# EAGLE board 14320^4 (EAGLE 7.6.0), part 1 of 2
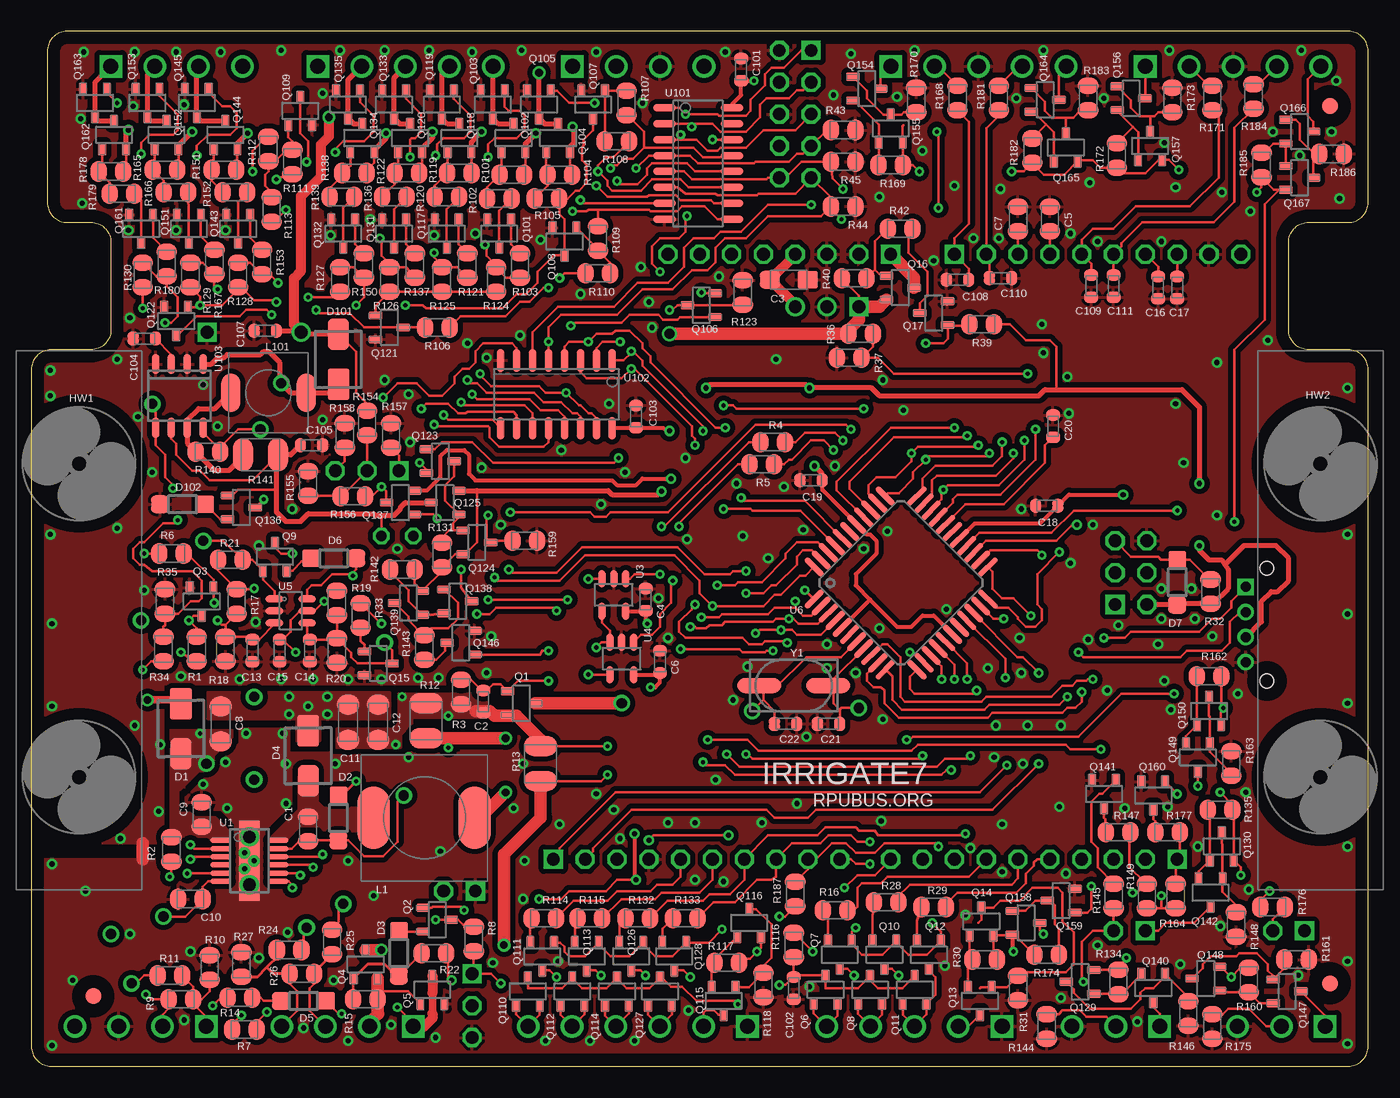
[diagram p2: board, top side]
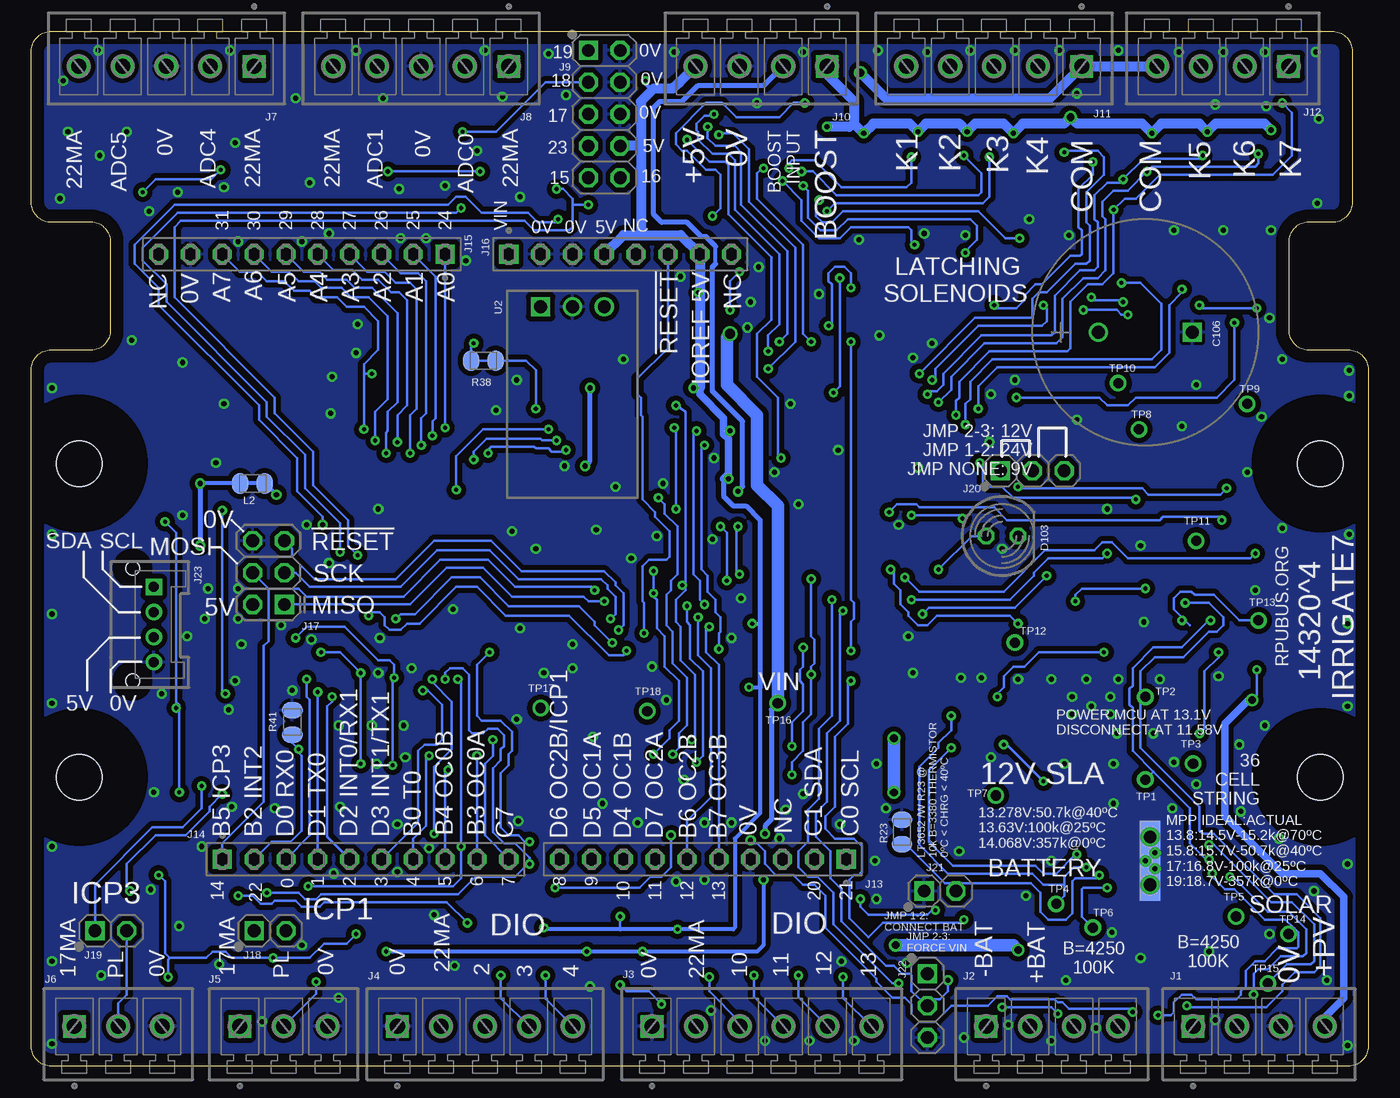
[diagram p3: board, bottom side, seen from below]

Size 106.68 x 82.55 mm. Coordinates in mm from the lower left corner, seen from the top.
Outline: 0,55.56 0,1.59 arc90 1.59,0 105.09,0 arc90 106.68,1.59 106.68,55.56 arc90 105.09,57.15 101.92,57.15 arc-90 100.33,58.74 100.33,65.72 arc-90 101.92,67.31 105.09,67.31 arc90 106.68,68.9 106.68,80.96 arc90 105.09,82.55 2.86,82.55 arc90 1.27,80.96 1.27,68.9 arc90 2.86,67.31 4.76,67.31 arc-90 6.35,65.72 6.35,58.74 arc-90 4.76,57.15 1.59,57.15 arc90 0,55.56
Copper layers (1*16): Top 0.035mm / dielectric 1.5mm / Bottom 0.035mm
Design rules "default *": minimum track width 10mil, minimum drill 16mil, track to track 8mil, track to pad 8mil, pad to pad 8mil, via to via 8mil, smd to smd 8mil, copper to edge 40mil, drill to drill 8mil, minimum pad ring 10mil, minimum via ring 8mil, stop-mask expansion 4mil, vias tented up to drill 17mil, thermal gap 10mil
Net classes: 0 default: width 0.254 mm, drill 0.33 mm

## Footprints (pad centres in the part's own frame; a part is rotated, then mirrored left to right if it is on the bottom)
C0805(2012) = smd 1.321 x 1.651: 1 -0.977,0; 2 0.977,0
C0603(1608) = smd 0.898 x 1.1: 1 -0.889,0; 2 0.889,0
3216 = smd 1.6 x 1.4: + -1.5,0; - 1.5,0
C1206(3216) = smd 1.6 x 1.8: 1 -1.4,0; 2 1.4,0
E7,5-18 = drill 1.016: + -3.75,0 | drill 1.016 square: - 3.75,0
SMA = smd 2.5 x 1.7: A 2,0; K -2,0
SOD123 = smd 1.4 x 1.4: A 1.8,0; C -1.8,0
LED5MM = drill 0.813 octagon: A -1.27,0; K 1.27,0
USA10 = hole 3.658: -12.5,0; 12.5,0
MCV4 = drill 1.2 square: 1 0,0 | drill 1.2: 2 3.5,0; 3 7,0; 4 10.5,0
MCV6 = drill 1.2 square: 1 0,0 | drill 1.2: 2 3.5,0; 3 7,0; 4 10.5,0; 5 14,0; 6 17.5,0
MCV5 = drill 1.2 square: 1 0,0 | drill 1.2: 2 3.5,0; 3 7,0; 4 10.5,0; 5 14,0
MCV3 = drill 1.2 square: 1 0,0 | drill 1.2: 2 3.5,0; 3 7,0
2X5 = drill 1.016 square: 1 0,0 | drill 1.016 octagon: 2 0,2.54; 3 2.54,0; 4 2.54,2.54; 5 5.08,0; 6 5.08,2.54; 7 7.62,0; 8 7.62,2.54; 9 10.16,0; 10 10.16,2.54
F1X10 = drill 1.016 square: 1 0,0 | drill 1.016 octagon: 2 2.54,0; 3 5.08,0; 4 7.62,0; 5 10.16,0; 6 12.7,0; 7 15.24,0; 8 17.78,0; 9 20.32,0; 10 22.86,0
F1X8 = drill 1.016 square: 1 0,0 | drill 1.016 octagon: 2 2.54,0; 3 5.08,0; 4 7.62,0; 5 10.16,0; 6 12.7,0; 7 15.24,0; 8 17.78,0
ISP = drill 1.016 square: 1 0,0 | drill 1.016 octagon: 2 0,2.54; 3 2.54,0; 4 2.54,2.54; 5 5.08,0; 6 5.08,2.54
1X2 = drill 1.016 square: 1 0,0 | drill 1.016 octagon: 2 2.54,0
1X3 = drill 1.016 square: 1 0,0 | drill 1.016 octagon: 2 2.54,0; 3 5.08,0
B04B = drill 0.8 square: 1 0,0 | drill 0.8: 2 2,0; 3 4,0; 4 6,0 | hole 1.1: 7.5,-1.7; -1.5,-1.7
L3939 = smd 2.6 x 5: 1 4.05,0; 2 -4.01,0
L2626 = smd 1.524 x 3.048: 1 3.01,0; 2 -3.01,0
SOT23 = smd 0.65 x 1.06: 1(G) -0.95,-1.1; 2(S) 0.95,-1.1; 3(D) 0,1.1
SOT23' = smd 0.65 x 1.06: B -0.95,-1.1; C 0,1.1; E 0.95,-1.1
C1210(3225) = smd 1.6 x 2.7: 1 -1.4,0; 2 1.4,0
P1-08 = drill 0.813: TP 0,0
12MSOP-EDP-HAND = smd 0.42 x 1.6: 1 -1.625,-2.3; 2 -0.975,-2.3; 3 -0.325,-2.3; 4 0.325,-2.3; 5 0.975,-2.3; 6 1.625,-2.3; 7 1.625,2.3; 8 0.975,2.3; 9 0.325,2.3; 10 -0.325,2.3; 11 -0.975,2.3; 12 -1.625,2.3 | smd 6.35 x 1.651: SNK0 0,0 | smd 6.35 x 1.651 bottom: SNK1 0,0 | drill 1.016: SNK3 -1.905,0; SNK5 1.905,0 | drill 0.406: SNK4 0,0.381; SNK6 -0.635,-0.381; SNK7 0.635,-0.381
OKI-78SR-H = drill 1.016 square: 1 0,0 | drill 1.016: 2 -2.54,0; 3 -5.08,0
SOT23-5 = smd 0.55 x 1.4: 1 -0.95,-1.3; 2 0,-1.3; 3 0.95,-1.3; 4 0.95,1.3; 5 -0.95,1.3
SOT23-6 = smd 0.55 x 1.4: 1 -0.95,-1.3; 2 0,-1.3; 3 0.95,-1.3; 4 0.95,1.3; 5 0,1.3; 6 -0.95,1.3
TQFP44 = smd 2 x 0.45: 1 -5.8,4; 2 -5.8,3.2; 3 -5.8,2.4; 4 -5.8,1.6; 5 -5.8,0.8; 6 -5.8,0; 7 -5.8,-0.8; 8 -5.8,-1.6; 9 -5.8,-2.4; 10 -5.8,-3.2; 11 -5.8,-4; 23 5.8,-4; 24 5.8,-3.2; 25 5.8,-2.4; 26 5.8,-1.6; 27 5.8,-0.8; 28 5.8,0; 29 5.8,0.8; 30 5.8,1.6; 31 5.8,2.4; 32 5.8,3.2; 33 5.8,4 | smd 0.45 x 2: 12 -4,-5.8; 13 -3.2,-5.8; 14 -2.4,-5.8; 15 -1.6,-5.8; 16 -0.8,-5.8; 17 0,-5.8; 18 0.8,-5.8; 19 1.6,-5.8; 20 2.4,-5.8; 21 3.2,-5.8; 22 4,-5.8; 34 4,5.8; 35 3.2,5.8; 36 2.4,5.8; 37 1.6,5.8; 38 0.8,5.8; 39 0,5.8; 40 -0.8,5.8; 41 -1.6,5.8; 42 -2.4,5.8; 43 -3.2,5.8; 44 -4,5.8
16SOIC = smd 0.6 x 1.8: 1 -4.445,-2.7; 2 -3.175,-2.7; 3 -1.905,-2.7; 4 -0.635,-2.7; 5 0.635,-2.7; 6 1.905,-2.7; 7 3.175,-2.7; 8 4.445,-2.7; 9 4.445,2.7; 10 3.175,2.7; 11 1.905,2.7; 12 0.635,2.7; 13 -0.635,2.7; 14 -1.905,2.7; 15 -3.175,2.7; 16 -4.445,2.7
SOIC8 = smd 0.6 x 1.6: 1 -1.905,-2.54; 2 -0.635,-2.54; 3 0.635,-2.54; 4 1.905,-2.54; 5 1.905,2.54; 6 0.635,2.54; 7 -0.635,2.54; 8 -1.905,2.54
FIDUCIAL-1.27 = smd 1.27 x 1.27: 1 0,0
CSM-3X = smd 3.5 x 1.2: 1 -2.75,0; 2 2.75,0

## Placement (x,y rotation side)
C1  1uF  [C0805(2012)]  22.1,18.92 90 top
C2  10nF  [C0603(1608)]  36.07,29.08 90 top
C3  106A  [3216]  60.45,62.74 0 top
C4  .1uF  [C0603(1608)]  49.02,37.21 90 top
C5  1uF  [C0805(2012)]  81.28,67.56 90 top
C6  .1uF  [C0603(1608)]  50.16,32.26 90 top
C7  1uF  [C0805(2012)]  78.74,67.56 90 top
C8  10uF  [C1206(3216)]  15.11,27.3 90 top
C9  .1uF  [C0805(2012)]  13.59,20.07 90 top
C10  1uF  [C0805(2012)]  12.7,13.34 180 top
C11  10uF  [C1206(3216)]  25.27,27.43 90 top
C12  10uF  [C1206(3216)]  27.69,27.43 90 top
C13  .1uF  [C0603(1608)]  17.65,33.15 270 top
C14  .1uF  [C0603(1608)]  22.23,33.15 270 top
C15  .1uF  [C0603(1608)]  19.81,33.15 270 top
C16  .01uF  [C0603(1608)]  89.92,62.1 270 top
C17  .01uF  [C0603(1608)]  91.44,62.1 270 top
C18  .1uF  [C0603(1608)]  81.03,44.7 180 top
C19  .1uF  [C0603(1608)]  62.23,46.74 180 top
C20  .1uF  [C0603(1608)]  81.53,51.05 90 top
C21  27pF  [C0603(1608)]  63.63,27.3 0 top
C22  27pF  [C0603(1608)]  60.2,27.3 180 top
C101  .1uF  [C0603(1608)]  56.64,79.5 90 top
C102  .1uF  [C0603(1608)]  60.83,6.22 270 top
C103  .1uF  [C0603(1608)]  48.26,51.82 90 top
C104  330pF  [C0603(1608)]  9.02,58.04 180 top
C105  .1uF  [C0603(1608)]  22.35,49.53 0 top
C106  PW1J222  [E7,5-18]  17.78,58.55 0 bottom
C107  .1uF  [C0603(1608)]  18.67,58.67 180 top
C108  .01uF  [C0603(1608)]  73.91,62.74 180 top
C109  .01uF  [C0603(1608)]  84.58,62.23 270 top
C110  .01uF  [C0603(1608)]  77.34,62.87 0 top
C111  .01uF  [C0603(1608)]  86.36,62.23 270 top
D1  SQ4  [SMA]  11.94,26.92 90 top
D2  T4  [SOD123]  24.51,19.81 90 top
D3  T4  [SOD123]  29.34,9.02 90 top
D4  SQ4  [SMA]  22.1,24.77 90 top
D5  T4  [SOD123]  21.72,5.21 0 top
D6  T4  [SOD123]  24.13,40.51 180 top
D7  T4  [SOD123]  91.44,38.61 90 top
D101  SQ4  [SMA]  24.51,56.39 270 top
D102  T4  [SOD123]  12.07,44.83 0 top
D103  5MMRD  [LED5MM]  29.21,42.29 0 bottom
HW1  [USA10]  3.81,35.56 90 top
HW2  [USA10]  102.87,35.56 90 top
HW3  ARDUINO-UNO  [ARDUINO_UNO]  22.86,67.31 180 bottom
J1  PST1,0/4-3,5  [MCV4]  13.97,3.17 0 bottom
J2  PST1,0/4-3,5  [MCV4]  30.48,3.17 0 bottom
J3  PST1,0&6-3,5  [MCV6]  57.15,3.17 0 bottom
J4  PST1,0/5-3,5  [MCV5]  77.47,3.17 0 bottom
J5  PST1,0&3-3,5  [MCV3]  90.04,3.17 0 bottom
J6  PST1,0&3-3,5  [MCV3]  103.25,3.17 0 bottom
J7  PST1,0/5-3,5  [MCV5]  88.9,79.76 180 bottom
J8  PST1,0/5-3,5  [MCV5]  68.58,79.76 180 bottom
J9  [2X5]  62.23,81.03 270 bottom
J10  PST1,0/4-3,5  [MCV4]  43.18,79.76 180 bottom
J11  PST1,0/5-3,5  [MCV5]  22.86,79.76 180 bottom
J12  PST1,0/4-3,5  [MCV4]  6.35,79.76 180 bottom
J13  PPPC101LFBN  [F1X10]  41.66,16.51 180 bottom
J14  PPPC101LFBN  [F1X10]  91.44,16.51 0 bottom
J15  PPPC101LFBN  [F1X10]  73.66,64.77 180 bottom
J16  PPPC081LFBN  [F1X8]  68.58,64.77 0 bottom
J17  ISP-SPI  [ISP]  86.49,36.83 90 bottom
J18  [1X2]  88.9,10.79 0 bottom
J19  [1X2]  101.6,10.79 0 bottom
J20  PBC03SAA  [1X3]  29.34,47.5 0 bottom
J21  [1X2]  35.43,13.97 0 bottom
J22  PBC03SAA  [1X3]  35.18,7.37 270 bottom
J23  S04B  [B04B]  96.9,38.23 270 bottom
L1  15uH 2A2  [L3939]  31.37,19.81 180 top
L2  MH2029-300Y  [C0805(2012)]  89.03,46.48 0 bottom
L101  150UH 0A3  [L2626]  18.92,53.72 0 top
Q1  DMB  [SOT23]  39.12,28.96 270 top
Q2  K38  [SOT23]  32.38,11.68 270 top
Q3  K1N  [SOT23']  13.59,37.08 180 top
Q4  DMB  [SOT23]  26.67,8.13 0 top
Q5  34N  [SOT23]  32,6.1 0 top
Q6  K1N  [SOT23']  63.37,6.1 0 top
Q7  K38  [SOT23]  64.52,8.89 180 top
Q8  K1N  [SOT23']  66.93,6.1 0 top
Q9  K38  [SOT23]  19.43,40.64 0 top
Q10  K38  [SOT23]  68.07,8.89 180 top
Q11  K1N  [SOT23']  70.48,6.1 0 top
Q12  K38  [SOT23]  71.63,8.89 180 top
Q13  K3N  [SOT23']  75.69,5.21 180 top
Q14  K3N  [SOT23']  75.82,11.56 0 top
Q15  K1N  [SOT23']  27.69,32.13 270 top
Q16  DMB  [SOT23]  69.34,62.1 270 top
Q17  K38  [SOT23]  72.01,60.07 90 top
Q101  K1N  [SOT23']  37.34,66.42 180 top
Q102  DMB  [SOT23]  38.48,74.04 0 top
Q103  34N  [SOT23]  36.83,76.71 180 top
Q104  DMB  [SOT23]  42.04,74.04 0 top
Q105  34N  [SOT23]  40.51,76.71 180 top
Q106  K3N  [SOT23']  53.47,60.71 90 top
Q107  K1N  [SOT23']  44.83,76.71 180 top
Q108  K1N  [SOT23']  42.54,65.79 180 top
Q109  K1N  [SOT23']  21.46,76.2 0 top
Q110  K1N  [SOT23']  39.62,5.97 0 top
Q111  K38  [SOT23]  40.77,8.76 180 top
Q112  K1N  [SOT23']  43.18,5.97 0 top
Q113  K38  [SOT23]  44.32,8.76 180 top
Q114  K1N  [SOT23']  46.74,5.97 0 top
Q115  K3N  [SOT23']  55.24,5.21 180 top
Q116  K3N  [SOT23']  57.28,11.43 0 top
Q117  K1N  [SOT23']  33.15,66.42 180 top
Q118  DMB  [SOT23]  34.16,74.04 0 top
Q119  34N  [SOT23]  32.77,76.71 180 top
Q120  DMB  [SOT23]  30.23,74.04 0 top
Q121  K1N  [SOT23']  28.57,58.93 270 top
Q122  K1N  [SOT23']  11.56,59.44 180 top
Q123  K38  [SOT23]  32.64,48.26 270 top
Q124  K84  [SOT23]  35.56,41.78 270 top
Q125  DMB  [SOT23]  33.02,44.96 90 top
Q126  K38  [SOT23]  47.88,8.76 180 top
Q127  K1N  [SOT23']  50.16,5.97 0 top
Q128  K38  [SOT23]  51.31,8.76 180 top
Q129  K3N  [SOT23']  83.69,6.73 90 top
Q130  K3N  [SOT23']  95,17.53 0 top
Q131  K1N  [SOT23']  28.96,66.42 180 top
Q132  K1N  [SOT23']  24.89,66.42 180 top
Q133  34N  [SOT23]  28.96,76.71 180 top
Q134  DMB  [SOT23]  26.42,74.04 0 top
Q135  34N  [SOT23]  25.27,76.71 180 top
Q136  K38  [SOT23]  16.76,44.58 270 top
Q137  K84  [SOT23]  29.46,44.96 90 top
Q138  K3N  [SOT23']  34.04,37.08 270 top
Q139  K3N  [SOT23']  30.1,36.96 90 top
Q140  K3N  [SOT23']  89.54,6.22 180 top
Q141  K1N  [SOT23']  85.6,21.72 180 top
Q142  K3N  [SOT23']  94.11,13.84 180 top
Q143  K1N  [SOT23']  16.51,66.8 180 top
Q144  DMB  [SOT23]  15.49,74.3 0 top
Q145  34N  [SOT23]  13.21,76.83 180 top
Q146  K38  [SOT23]  34.29,33.78 90 top
Q147  K3N  [SOT23']  100.2,5.97 270 top
Q148  K3N  [SOT23']  93.73,6.99 90 top
Q149  K3N  [SOT23']  93.09,24.64 180 top
Q150  K3N  [SOT23']  93.98,28.32 0 top
Q151  K1N  [SOT23']  12.57,66.8 180 top
Q152  DMB  [SOT23]  10.79,74.3 0 top
Q153  34N  [SOT23]  9.27,76.83 180 top
Q154  K3N  [SOT23']  66.67,77.98 270 top
Q155  K3N  [SOT23']  68.58,74.8 0 top
Q156  K3N  [SOT23']  87.76,77.22 270 top
Q157  K3N  [SOT23']  89.28,73.41 0 top
Q158  K84  [SOT23]  79.38,11.43 270 top
Q159  K38  [SOT23]  82.17,13.21 90 top
Q160  K1N  [SOT23']  89.54,21.59 180 top
Q161  K1N  [SOT23']  8.76,66.8 180 top
Q162  DMB  [SOT23]  6.6,74.3 0 top
Q163  34N  [SOT23]  5.08,76.83 180 top
Q164  K3N  [SOT23']  80.9,77.09 270 top
Q165  K3N  [SOT23']  82.55,73.28 0 top
Q166  K3N  [SOT23']  101.22,74.55 270 top
Q167  K3N  [SOT23']  101.22,70.87 270 top
R1  10k  [C0805(2012)]  13.21,33.27 90 top
R2  205k  [C0805(2012)]  11.18,17.27 270 top
R3  100k  [C0805(2012)]  34.29,29.84 90 top
R4  100k  [C0805(2012)]  59.18,49.78 180 top
R5  100k  [C0805(2012)]  58.29,48.01 180 top
R6  10k  [C0805(2012)]  11.18,40.89 0 top
R7  10k  [C0805(2012)]  17.02,2.92 180 top
R8  10k  [C0805(2012)]  35.31,10.16 270 top
R9  121k  [C0805(2012)]  11.94,5.33 0 top
R10  49.9k  [C0805(2012)]  14.22,7.87 90 top
R11  20k  [C0805(2012)]  11.05,7.24 180 top
R12  0R068  [C1210(3225)]  31.5,27.56 270 top
R13  0R068  [C1210(3225)]  40.64,24.13 90 top
R14  10k  [C0805(2012)]  16.64,5.46 180 top
R15  100k  [C0805(2012)]  26.67,5.33 180 top
R16  100  [C0805(2012)]  64.14,12.45 0 top
R17  316k  [C0805(2012)]  16.38,37.08 270 top
R18  10k  [C0805(2012)]  15.49,33.27 270 top
R19  280k  [C0805(2012)]  24.38,36.96 270 top
R20  10k  [C0805(2012)]  24.38,33.15 270 top
R21  100k  [C0805(2012)]  15.88,40.39 0 top
R22  5.62k  [C0805(2012)]  32.13,9.02 0 top
R23  **10k  [C0805(2012)]  37.21,18.67 90 bottom
R24  200k  [C0805(2012)]  20.57,9.27 180 top
R25  182k  [C0805(2012)]  24,9.91 270 top
R26  45.3k  [C0805(2012)]  21.59,7.37 180 top
R27  68.1k  [C0805(2012)]  16.76,8.13 270 top
R28  100  [C0805(2012)]  68.2,13.08 0 top
R29  100  [C0805(2012)]  72.01,12.7 0 top
R30  27  [C0805(2012)]  76.07,8.51 0 top
R31  49.9k  [C0805(2012)]  78.74,6.22 90 top
R32  10K  [C0805(2012)]  94.11,37.85 270 top
R33  10k  [C0805(2012)]  26.29,35.94 270 top
R34  432k  [C0805(2012)]  10.54,33.27 270 top
R35  100k  [C0805(2012)]  10.67,37.08 270 top
R36  200k  [C0805(2012)]  66.17,58.42 180 top
R37  100k  [C0805(2012)]  65.28,56.52 0 top
R38  JMP  [C0805(2012)]  70.61,56.26 180 bottom
R39  10k  [C0805(2012)]  75.82,59.18 0 top
R40  100k  [C0805(2012)]  65.66,62.87 0 top
R41  OPEN  [C0805(2012)]  85.85,27.43 90 bottom
R42  10k  [C0805(2012)]  69.34,66.8 0 top
R43  10k  [C0805(2012)]  64.77,74.68 0 top
R44  10k  [C0805(2012)]  64.77,68.58 0 top
R45  10k  [C0805(2012)]  64.77,72.14 0 top
R101  100K  [C0805(2012)]  38.35,71.12 0 top
R102  100K  [C0805(2012)]  37.34,69.22 180 top
R103  10K  [C0805(2012)]  38.99,63.88 90 top
R104  100K  [C0805(2012)]  42.16,71.12 0 top
R105  100K  [C0805(2012)]  41.15,69.22 180 top
R106  100K  [C0805(2012)]  32.38,58.93 0 top
R107  100K  [C0805(2012)]  47.5,76.83 90 top
R108  100K  [C0805(2012)]  46.74,73.79 180 top
R109  100K  [C0805(2012)]  45.21,66.04 270 top
R110  100K  [C0805(2012)]  45.21,63.25 0 top
R111  100K  [C0805(2012)]  20.83,72.14 90 top
R112  100K  [C0805(2012)]  18.92,73.15 270 top
R113  100K  [C0805(2012)]  19.18,68.33 90 top
R114  100  [C0805(2012)]  40.89,11.81 0 top
R115  100  [C0805(2012)]  44.58,11.81 0 top
R116  100K  [C0805(2012)]  60.83,9.65 270 top
R117  27  [C0805(2012)]  55.5,8.26 0 top
R118  49.9k  [C0805(2012)]  58.42,6.48 90 top
R119  100K  [C0805(2012)]  34.16,71.25 0 top
R120  100K  [C0805(2012)]  33.15,69.34 180 top
R121  10K  [C0805(2012)]  34.8,63.88 90 top
R122  100K  [C0805(2012)]  29.97,71.25 0 top
R123  10K  [C0805(2012)]  56.77,61.72 270 top
R124  100K  [C0805(2012)]  37.08,62.74 270 top
R125  100K  [C0805(2012)]  32.77,62.74 270 top
R126  100K  [C0805(2012)]  28.57,62.74 270 top
R127  100K  [C0805(2012)]  24.64,62.74 270 top
R128  100K  [C0805(2012)]  16.51,63.12 270 top
R129  100K  [C0805(2012)]  12.7,63.12 270 top
R130  100K  [C0805(2012)]  8.89,63.12 270 top
R131  10K  [C0805(2012)]  32.77,40.77 90 top
R132  100  [C0805(2012)]  48.39,11.81 0 top
R133  100  [C0805(2012)]  52.2,11.81 0 top
R134  32.4  [C0805(2012)]  86.74,6.73 90 top
R135  60.4  [C0805(2012)]  94.87,20.45 0 top
R136  100K  [C0805(2012)]  28.96,69.34 180 top
R137  10K  [C0805(2012)]  30.61,63.88 90 top
R138  100K  [C0805(2012)]  25.78,71.25 0 top
R139  100K  [C0805(2012)]  24.77,69.34 180 top
R140  182  [C0805(2012)]  14.1,49.02 0 top
R141  1  [C1210(3225)]  18.29,48.77 180 top
R142  32.4  [C0805(2012)]  29.59,39.62 0 top
R143  49.9k  [C0805(2012)]  31.37,33.4 90 top
R144  100  [C0805(2012)]  81.03,3.17 90 top
R145  10k  [C0805(2012)]  86.36,13.59 90 top
R146  49.9k  [C0805(2012)]  92.33,4.19 90 top
R147  182  [C0805(2012)]  86.74,18.67 0 top
R148  49.9k  [C0805(2012)]  96.14,11.3 90 top
R149  10k  [C0805(2012)]  89.03,13.59 90 top
R150  10K  [C0805(2012)]  26.54,63.88 90 top
R151  100K  [C0805(2012)]  15.37,71.5 0 top
R152  100K  [C0805(2012)]  16.26,69.72 180 top
R153  10K  [C0805(2012)]  18.41,64.14 90 top
R154  100K  [C0805(2012)]  26.8,51.31 270 top
R155  15.8k  [C0805(2012)]  22.1,46.48 270 top
R156  10K  [C0805(2012)]  25.65,45.47 0 top
R157  8.45k  [C0805(2012)]  28.7,50.29 90 top
R158  43.2k  [C0805(2012)]  25.02,50.29 90 top
R159  49.9k  [C0805(2012)]  39.37,41.91 180 top
R160  32.4  [C0805(2012)]  97.16,6.86 90 top
R161  49.9k  [C0805(2012)]  100.97,8.51 180 top
R162  60.4  [C0805(2012)]  93.98,31.11 0 top
R163  49.9k  [C0805(2012)]  95.76,24.13 270 top
R164  10k  [C0805(2012)]  91.31,13.59 90 top
R165  100K  [C0805(2012)]  10.67,71.5 0 top
R166  100K  [C0805(2012)]  11.56,69.72 180 top
R167  10K  [C0805(2012)]  14.61,64.14 90 top
R168  1.5k  [C0805(2012)]  73.91,77.22 90 top
R169  27  [C0805(2012)]  68.58,71.88 0 top
R170  49.9k  [C0805(2012)]  70.61,77.09 270 top
R171  1.5k  [C0805(2012)]  94.23,77.22 90 top
R172  27  [C0805(2012)]  86.61,72.64 270 top
R173  49.9k  [C0805(2012)]  91.06,77.09 270 top
R174  100K  [C0805(2012)]  81.03,8.89 180 top
R175  100  [C0805(2012)]  94.23,3.17 90 top
R176  10k  [C0805(2012)]  99.06,12.7 180 top
R177  182  [C0805(2012)]  90.68,18.67 0 top
R178  100K  [C0805(2012)]  6.35,71.37 0 top
R179  100K  [C0805(2012)]  7.24,69.6 180 top
R180  10K  [C0805(2012)]  10.79,64.01 90 top
R181  1.5k  [C0805(2012)]  77.22,77.22 90 top
R182  27  [C0805(2012)]  79.88,73.03 270 top
R183  49.9k  [C0805(2012)]  84.33,77.22 270 top
R184  1.5k  [C0805(2012)]  97.54,77.34 90 top
R185  27  [C0805(2012)]  98.17,71.88 270 top
R186  49.9k  [C0805(2012)]  103.76,72.77 180 top
R187  100K  [C0805(2012)]  60.96,13.72 90 top
TP1  TPPAD1-08  [P1-08]  17.78,22.86 0 bottom
TP2  TPPAD1-08  [P1-08]  17.78,29.46 0 bottom
TP3  TPPAD1-08  [P1-08]  13.97,24.13 0 bottom
TP4  TPPAD1-08  [P1-08]  24.89,12.95 0 bottom
TP5  TPPAD1-08  [P1-08]  10.54,11.94 0 bottom
TP6  TPPAD1-08  [P1-08]  21.97,11.05 0 bottom
TP7  TPPAD1-08  [P1-08]  29.72,21.59 0 bottom
TP8  TPPAD1-08  [P1-08]  18.29,50.8 0 bottom
TP9  TPPAD1-08  [P1-08]  9.65,52.83 0 bottom
TP10  TPPAD1-08  [P1-08]  19.94,54.48 0 bottom
TP11  TPPAD1-08  [P1-08]  13.72,41.91 0 bottom
TP12  TPPAD1-08  [P1-08]  28.19,33.78 0 bottom
TP13  TPPAD1-08  [P1-08]  8.76,35.56 0 bottom
TP14  TPPAD1-08  [P1-08]  6.35,10.54 0 bottom
TP15  TPPAD1-08  [P1-08]  8,6.6 0 bottom
TP16  TPPAD1-08  [P1-08]  47.12,28.96 0 bottom
TP17  TPPAD1-08  [P1-08]  66.04,28.57 0 bottom
TP18  TPPAD1-08  [P1-08]  57.53,28.32 0 bottom
U1  LT3652  [12MSOP-EDP-HAND]  17.4,16.38 270 top
U2  I50115  [OKI-78SR-H]  66.04,60.58 180 bottom
U3  1087  [SOT23-5]  46.48,37.59 180 top
U4  1087  [SOT23-5]  47.12,32.51 180 top
U5  TPS3700  [SOT23-6]  20.7,36.32 270 top
U6  ATMEGA1284P-AU  [TQFP44]  69.4,38.55 45 top
U101  74HC238  [16SOIC]  53.21,72.01 270 top
U102  74HC238  [16SOIC]  41.91,53.59 180 top
U103  MC34063A  [SOIC8]  11.81,53.47 180 top
U$2  FIDUCIAL1.27  [FIDUCIAL-1.27]  103.63,76.58 0 top
U$3  FIDUCIAL1.27  [FIDUCIAL-1.27]  103.63,6.6 0 top
U$4  FIDUCIAL1.27  [FIDUCIAL-1.27]  4.95,5.59 0 top
Y1  16MHz  [CSM-3X]  60.83,30.35 180 top

## Tracks (layer width: path | path; a pad name or v marks a point on that pad's centre or on a via)
0V  (via drill 0.41)
  Top 1.016: 8.89,17.78 8.89,16.51
  other vias: 20.57,29.46 22.1,28.7 23.62,29.46 23.62,28.07 16.64,30.86 19.94,30.86 22.48,30.86 20.32,20.95 17.14,26.54 20.32,24.13 20.07,26.54 25.27,30.86 27.94,30.86 20.57,28.07 30.1,24.64 15.49,24.26 13.72,22.48 15.62,20.57 1.65,16.13 10.16,20.32 10.29,25.65 6.86,42.93 1.52,42.42 11.94,31.11 24.26,24.13 25.27,16.38 27.3,13.59 12.19,3.68 32.64,17.14 20.45,10.67 12.7,9.14 4.32,13.97 8.26,80.9 4.19,80.9 80.77,81.03 27.05,67.56 7.75,66.67 3.94,75.56 4.06,68.83 35.43,66.42 54.86,62.99 59.44,56.39 36.7,34.29 35.18,80.9 19.94,81.03 28.19,81.03 24.64,81.03 70.48,81.03 55.37,80.9 65.41,80.77 40.64,65.91 8.51,51.82 1.52,53.47 1.52,55.5 7.87,59.69 23.24,51.56 13.72,54.36 9.65,47.37 6.86,56.39 36.32,31.37 49.53,58.93 72.01,64.26 101.35,81.03 75.18,66.04 82.93,66.42 77.22,66.04 90.81,81.03 69.6,52.32 67.95,54.74 64.14,47.88 80.65,59.18 85.09,65.79 66.42,41.27 67.69,34.92 73.03,36.45 50.8,34.16 67.95,27.69 63.5,33.66 76.33,31.75 46.99,18.16 39.37,16.38 58.29,19.43 54.61,22.86 50.8,19.43 45.08,21.72 46.48,20.45 92.84,35.69 94.62,56.13 105.03,54.1 32.51,30.99 68.33,42.67 29.21,41.27 20.83,44.45 18.16,41.53 9.02,37.97 30.86,30.99 60.07,46.23 11.56,80.9 31.75,81.03 39.12,81.03 82.8,52.07 15.11,80.9 8.13,76.58 11.56,66.67 15.49,66.67 23.88,66.29 23.24,77.6 12.19,76.71 14.86,51.05 65.79,31.37 63.5,31.75 32.13,66.29 21.72,3.05 35.94,47.75 47.37,47.37 30.23,49.78 37.46,43.18 42.29,49.15 36.32,56.52 45.08,80.9 48.64,63.75 49.28,60.96 43.81,61.59 34.8,57.66 28.19,54.74 46.1,52.83 80.77,56.9 30.1,53.59 17.91,35.43 50.04,37.34 36.83,8.26 52.96,19.43 55.24,14.73 24.13,6.86 42.04,8.38 38.48,20.57 39.24,24.13 42.16,19.3 39.24,13.34 52.96,14.86 67.82,19.56 61.09,20.95 76.84,24.64 79.12,24.13 77.47,19.3 74.93,17.4 77.47,15.49 82.55,15.37 82.04,20.7 78.99,31.37 78.87,34.16 82.93,40.13 78.99,44.45 91.95,48.13 91.31,52.83 105.03,42.42 105.03,28.96 105.03,36.07 92.58,38.1 98.68,57.91 104.39,69.22 91.31,70.1 101.22,72.64 99.06,74.55 90.42,73.66 69.09,77.34 71.12,73.03 64.01,77.47 67.69,69.34 73.66,70.23 78.61,77.22 84.45,70.48 85.6,77.22 77.34,69.98 103.76,74.55 104.14,78.61 97.28,68.2 90.17,65.79 82.68,54.99 84.71,43.18 86.74,35.18 85.85,29.97 85.09,9.65 94.87,11.18 97.16,14.1 93.09,17.53 82.17,5.46 74.55,12.06 62.1,6.35 52.45,4.45 48.13,2.03 44.58,2.03 25.27,2.03 28.7,3.3 32.26,2.29 41.02,2.03 38.99,58.29 45.47,44.83 52.2,48.51 52.32,42.04 56.26,46.48 56.77,42.29 57.15,31.88 56.01,29.21 61.85,26.29 76.96,27.18 79.5,27.18 82.17,27.18 87.25,20.57 90.68,20.7 96.9,21.84 90.42,30.73 96.27,29.72 94.62,43.94 105.03,17.53 105.03,8.38 105.03,1.78 101.09,7.24 88.27,3.56 91.69,8.13 72.9,8 18.16,8.64 7.87,10.54 3.3,6.86 1.65,1.65 7.11,18.16 1.65,28.7 8.26,27.18 1.65,35.31 90.17,35.69 84.33,34.04 94.23,34.29 89.92,33.66 90.93,28.45 61.59,42.8 58.8,40.51 95,69.72 90.17,38.1 48.77,76.83
  pour Top (isolate 0.406, rank 3): 0,82.55 106.68,82.55 106.68,0 0,0 0,16.51 16.26,16.51 16.26,19.43 16.13,19.43 15.11,20.45 12.7,20.45 12.32,20.83 12.32,21.46 16.64,25.78 16.64,26.92 20.57,26.92 20.57,25.02 34.29,25.02 34.29,30.48 10.54,30.48 10.54,17.78 0,17.78
  pour Bottom (isolate 0.406): 0,82.55 106.68,82.55 106.68,0 0,0
  pour Top (isolate 0.406, no thermals): 14.1,29.84 28.57,29.84 28.57,27.69 22.99,27.69 22.99,25.91 21.21,25.91 21.21,27.69 14.1,27.69
22MA_ADC0
  Top 0.203: Q154.C 67.78,78.95 J8.1
22MA_ADC1
  Top 0.203: Q164.C 82,79.17 J8.5
22MA_ADC4
  Top 0.203: J7.1 88.9,77.26 Q156.C
22MA_ADC5
  Top 0.203: Q166.C 102.32,75.35 101.85,75.82 101.85,78.71 J7.5
22MA_DIO2
  Top 0.203: J4.2 74.76,3.17 Q13.C
22MA_DIO10
  Top 0.203: J3.2 53.65,4.25 53.85,4.45 54.48,4.45 54.82,4.11 Q115.C
!RESET!  (via drill 0.33)
  Top 0.203: U6.4 63.01,34.42 61.09,34.42 60.71,34.8 v59.82,34.8 58.17,34.8 57.91,34.54 v57.78,34.54 | 93.85,38.99 92.46,40.39 91.46,40.39 | D7.A 90.15,40.41 89.92,40.64 87.76,40.64 J17.5
  Top 0.254: R32.1 93.85,38.99 | 91.46,40.39 D7.A
  Bottom 0.203: v59.82,34.8 59.44,35.18 59.44,37.72 60.07,38.35 60.07,38.61 60.96,39.5 67.56,39.5 69.98,41.91 74.55,41.91 77.6,38.86 84.07,38.86 85.85,40.64 85.85,41.27 J17.5 | v57.78,34.54 57.78,36.96 57.91,37.08 57.91,39.88 57.4,40.39 56.01,40.39 55.75,40.64 55.75,42.67 56.9,43.81 56.9,44.2 57.91,45.21 57.91,51.82 58.04,51.94 58.04,53.34 58.29,53.59 58.29,54.86 55.88,57.28 J16.6
+5V  (via drill 0.33, 0.41)
  Top 0.203: Q106.E 53.53,61.66 v53.47,61.72 | R39.2 78.11,59.18 79.38,57.91 81.28,57.91 81.79,57.4 81.79,53.98 | Q111.1(G) 42.21,9.86 42.54,9.53 42.54,9.14 42.93,8.76 44.17,8.76 Q113.1(G) 45.27,9.72 46.23,8.76 47.73,8.76 Q126.1(G) 48.83,9.72 49.78,8.76 51.16,8.76 Q128.1(G) 54.06,9.86 v55.12,10.92 | v65.79,11.05 65.47,10.73 Q7.1(G) 65.47,9.72 66.29,8.89 67.92,8.89 Q10.1(G) 69.02,9.85 69.98,8.89 71.48,8.89 Q12.1(G) 72.6,9.99 72.6,10.71 v71.88,11.43 | R149.1 90.17,12.61 | 90.17,12.61 R164.1 | v90.17,13.59 90.17,12.61 | R187.1 60.16,11.94 v59.69,11.94
  Top 0.254: 91.5,36.87 D7.C | 89.05,36.81 J17.2
  Top 0.305: C19.1 63.12,45.96 U6.38 66.66,42.42 66.93,42.42 67.44,41.91 67.44,40.89 65.79,39.24 65.79,38.35 66.93,37.21 | 66.93,37.21 69.09,35.05 70.23,35.05 71.12,35.94 72.01,35.94 | U6.17 72.01,35.94 | 72.01,35.94 | U6.5 66.93,37.21 | U6.27 75.29,43.31 80.52,43.31 C18.1 81.95,44.79 82.04,44.83 82.8,45.59 v87.12,45.59 | Q137.2(S) 31.56,45.91 32.64,46.99 32.64,48.64 33.15,49.15 34.54,49.15 34.92,48.77 34.92,47.24 35.43,46.74 46.35,46.74 46.74,46.35 48.26,46.35 48.77,46.86 v51.05,46.86 | v57.66,78.61 C101.1 56.64,77.47 55.91,76.74 U101.16 | U102.16 46.39,50.93 C103.1 50.42,50.93 50.67,50.67 v50.93,50.67 | v49.15,35.31 49.02,35.43 C4.1 48.99,36.29 U3.5 | U4.5 50.01,31.21 C6.1 50.16,30.61 49.78,30.23 v49.4,30.23
  Top 0.406: v53.85,54.1 54.1,54.36 61.85,54.36 v62.1,54.1 67.06,54.1 67.69,53.47 80.39,53.47 80.9,53.98 81.79,53.98 91.82,53.98 93.22,52.58 v93.22,46.48 | C19.1 63.12,47.24 v62.48,47.88 | 91.5,36.87 R32.2 94.27,36.87 95.5,38.1 95.5,39.62 95.25,40.01 | D7.C 89.05,36.81 | v93.22,41.53 93.22,41.15 93.98,40.39 95,40.39 95.25,40.01 | J23.3 96.97,34.23 98.17,35.43 98.17,37.08 98.93,37.85 99.44,37.85 100.33,38.73 100.33,40.51 99.31,41.53 96.77,41.53 95.25,40.01
  Top 0.813: U2.3 60.96,60.73 C3.+ 60.96,64.75 J16.4
  Bottom 0.203: v50.93,50.67 51.43,50.67 | v53.47,61.72 53.34,61.72 | v71.88,11.43 73.53,13.08 83.31,13.08 83.69,12.7 85.09,12.7 85.6,13.21 87.25,13.21 87.5,12.95 88.39,12.95 89.03,13.59 v90.17,13.59 | v59.69,11.94 59.69,10.92
  Bottom 0.254: v51.05,46.86 51.43,46.86
  Bottom 0.305: v57.66,78.61 57.66,78.36 57.15,77.85 | v49.15,35.31 48.51,35.31 | v49.4,30.23 48.51,30.23 48.51,20.19 50.55,18.16 50.55,11.05 50.67,10.92 v55.12,10.92 59.69,10.92 65.66,10.92 v65.79,11.05 | v93.22,46.48 L2.1 L2.2 | 88.01,46.48 v87.12,45.59
  Bottom 0.406: v53.85,54.1 53.34,54.1 | 48.51,30.23 48.51,35.31 48.51,43.56 49.66,44.7 50.67,44.7 51.43,45.47 51.43,46.86 | v62.48,47.88 62.1,48.26 v62.1,54.1 | v93.22,46.48 v93.22,41.53 | L2.2 88.01,46.48
  Bottom 0.61: 53.34,54.1 53.34,53.59 51.43,51.69 51.43,50.67 51.43,50.42 51.05,50.04 51.05,47.24 51.43,46.86
  Bottom 0.813: 53.34,54.1 53.34,61.72 J16.7 54.86,66.29 58.04,66.29 | J16.4 59.44,66.29 58.04,66.29 | 58.04,73.41 58.04,66.29 | 58.04,73.41 58.04,76.96 57.15,77.85 57.02,77.98 55.5,77.98 54.99,78.44 J10.4 | 58.04,73.41 J9.8
-BAT  (via drill 0.33)
  Top 0.203: J2.1 30.48,3.43 v29.21,4.7 | v24.77,4.19 24.53,4.19 D5.A
  Top 0.61: 32,5.84 32,4.19
  Top 0.813: Q5.3(D) 32,5.84 | 32,4.19 32,3.81 31.37,3.17 J2.1
  Bottom 0.203: v29.21,4.7 25.27,4.7 v24.77,4.19
ADC0  (via drill 0.33)
  Top 0.203: v73.66,50.93 68.58,50.93 64.26,46.61 64.26,45.95 U6.37 | C108.1 74.8,63.63 J15.1 73.66,66.04 74.8,67.18 74.8,75.35 R168.1
  Bottom 0.203: J15.1 v73.66,50.93
ADC1  (via drill 0.33)
  Top 0.203: v74.68,50.29 74.55,50.16 68.83,50.16 65.28,46.61 65.28,46.07 U6.36 | C110.1 76.45,64.52 J15.2 76.2,74.8 77.22,75.82 R181.1
  Bottom 0.203: J15.2 74.42,62.99 74.42,51.69 74.68,51.44 v74.68,50.29
ADC4  (via drill 0.33)
  Top 0.203: v77.47,49.78 77.47,48.64 76.71,47.88 72.14,47.88 71.12,46.86 71.12,45.92 U6.33 | C109.1 84.58,64.01 J15.5 83.82,65.91 84.71,66.8 86.36,66.8 88.14,68.58 92.46,68.58 94.74,70.87 94.74,75.73 R171.1
  Bottom 0.203: J15.5 82.55,63.5 81.03,63.5 80.26,62.74 78.99,62.74 77.98,61.72 77.34,61.72 76.71,61.09 76.71,52.7 77.47,51.94 v77.47,49.78
ADC5  (via drill 0.33)
  Top 0.203: U6.32 71.88,45.59 71.88,46.74 72.26,47.12 76.96,47.12 78.36,48.51 v78.36,48.9 | C111.1 J15.6 87,65.41 87,65.66 88.65,67.31 88.9,67.31 94.36,67.31 96.01,68.96 96.01,74.84 R184.1
  Bottom 0.203: v78.36,48.9 78.36,50.55 78.23,50.67 78.23,52.2 77.47,52.96 77.47,60.07 79.5,62.1 80.9,62.1 81.53,62.74 83.06,62.74 83.69,63.37 84.96,63.37 J15.6
AREF
  Top 0.203: U6.29 74.55,44.83 77.6,44.83 80.9,48.13 80.9,49.53 C20.1
BAT
  Top 0.203: 27.65,5.97 30.08,5.97 Q5.1(G)
  Top 1.016: J2.2 26.98,3.48 27.69,4.19 27.65,4.23 R15.1 27.65,5.97 27.65,7 Q4.2(S)
BAT-DISCON
  Top 0.203: D3.C 29.35,7.22 R22.1 | R15.2 25.69,7 Q4.1(G)
  Top 0.254: D3.C 29.11,7.22 28.19,8.13 26.82,8.13 Q4.1(G)
BAT_I  (via drill 0.33, 0.61)
  Top 0.203: R13.1 45.46,22.73 v45.97,23.24 | U3.3 44.48,38.89 v44.45,38.86 | v44.45,31.24 46.14,31.24 U4.4
  Top 1.016: Q4.3(D) 27.77,9.23 v27.94,9.27 | v37.72,9.65 37.72,16.89 40.64,19.81 R13.1
  Bottom 0.203: v45.97,23.24 45.97,24.26 45.08,25.15 45.08,27.43 44.45,28.07 v44.45,31.24 44.45,31.88 44.2,32.13 44.2,34.04 44.45,34.29 v44.45,38.86
  Bottom 1.016: v27.94,9.27 28.32,9.65 v37.72,9.65
BOOST  (via drill 0.41, 0.61)
  Top 0.203: R154.1 26.8,52.83 25.91,53.72 25.91,56.99 D101.K | Q162.2(S) 7.55,71.6 R178.2 | Q152.2(S) 11.75,71.6 R165.2 | Q144.2(S) 16.44,71.6 R151.2 | Q134.2(S) 27.37,72.07 26.8,71.5 R138.2 | Q120.2(S) 31.18,71.47 R122.2 | Q118.2(S) 35.11,71.35 R119.2 | Q102.2(S) 39.43,71.22 R101.2 | Q104.2(S) 42.99,71.27 R104.2
  Top 0.406: D101.K 21.69,58.39 C106.+ 21.4,58.67 C107.1 | Q162.2(S) 7.55,74.48 v7.75,74.68 | Q152.2(S) 11.75,73.47 v12.83,74.55 | Q144.2(S) 16.44,73.59 v17.27,74.42 | Q134.2(S) 27.24,72.96 28.32,74.04 v28.32,74.42 | v32,74.55 32,74.04 | 32,74.02 32,74.04 | 32,74.04 31.18,73.21 Q120.2(S) | Q118.2(S) 35.11,73.72 v35.94,74.55 | Q102.2(S) 39.43,73.59 v40.26,74.42 | Q104.2(S) 42.99,73.34 43.31,73.66 43.31,74.8 v43.18,74.93
  Top 0.813: C106.+ 21.46,58.67 20.96,59.18 20.96,62.87 21.53,63.44 21.53,69.41 23.11,70.99 23.11,73.53 23.75,74.17 v23.75,75.69
  Bottom 0.813: v7.75,74.68 8.26,75.18 12.19,75.18 v12.83,74.55 13.46,75.18 16.51,75.18 v17.27,74.42 18.03,75.18 23.24,75.18 v23.75,75.69 24.26,75.18 27.56,75.18 v28.32,74.42 29.08,75.18 31.37,75.18 v32,74.55 32.64,75.18 35.31,75.18 v35.94,74.55 36.58,75.18 39.5,75.18 v40.26,74.42 41.02,75.18 | 41.02,75.18 41.4,74.93 v43.18,74.93 | J10.1 43.18,79.12 41.02,76.96 41.02,75.18
BOOST17MA
  Top 0.203: Q146.3(D) 33.02,33.53 33.02,33.15 32.3,32.42 R143.1
BOOST_IN  (via drill 0.41)
  Top 0.203: 35.56,45.91 35.56,41.78 34.61,40.83 Q124.2(S) 33.81,40.83 R131.1 32.77,39.47 Q139.E 30.57,38.54 R142.2
  Top 0.406: Q125.2(S) 35.56,45.91 46.04,45.91 46.35,45.59 50.04,45.59 50.1,45.65 v50.29,45.85
  Bottom 0.305: 52.07,64.01 52.07,65.41
  Bottom 0.406: v50.29,45.85 49.91,46.23 49.91,51.44 52.32,53.85 52.32,63.75 52.07,64.01 | 52.07,65.41 52.83,66.17 53.21,66.17 54.36,67.31 56.39,67.31 57.02,67.94 57.02,76.45 56.51,76.96 54.74,76.96 53.47,78.23 48.2,78.23 J10.2
CHRG_ADC2  (via drill 0.33)
  Top 0.203: 75.44,49.4 70.74,49.4 v70.23,48.9 70.23,48.26 68.96,46.99 67.44,46.99 66.8,46.35 66.8,45.67 U6.35 | v64.01,49.15 63.25,49.91 62.23,49.91 60.71,48.39 60.45,48.39 60.07,48.01 R5.1 | C7.1 J15.3
  Top 0.254: v75.56,49.53 75.44,49.4
  Bottom 0.203: J15.3 77.22,63.25 75.82,63.25 75.18,62.61 75.18,52.07 75.56,51.69 v75.56,49.53 | v64.01,49.15 64.14,49.02 65.15,49.02 65.41,49.28 66.42,49.28 66.55,49.4 69.98,49.4 70.23,49.15 v70.23,48.9
COM  (via drill 0.61)
  Top 0.406: Q104.3(D) 40.98,75.14 Q105.3(D) v40.51,79.25
  Bottom 0.813: v40.51,79.25 38.48,77.22 25.4,77.22 J11.1 J12.4
CS_PWR  (via drill 0.33)
  Top 0.203: 69.53,71.91 R169.2 | Q167.E 99.57,69.92 | 99.57,69.92 99.16,69.92 R185.2 98.17,70.1 v97.79,69.72 | Q158.3(D) 80.48,10.84 v80.77,10.54 | v96.52,15.24 96.52,15.85 Q130.E 95.95,20.35 R135.2 95.85,20.87 v94.87,21.84 | v96.01,43.43 96.01,57.15 98.42,59.56 98.42,68.77 99.57,69.92 | 69.6,75.06 69.53,74.99 Q155.E 69.56,73.68 R169.2 | v70.87,71.37 70.36,71.88 R169.2 | Q150.E 94.93,28.38 v95.12,28.57 94.96,28.74 R162.2 | R160.2 96.48,7.83 v95.76,7.11 94.94,7.93 Q148.E | Q129.E 84.82,7.71 R134.2 87.12,8.09 87.12,8.26 87.38,8.51 v87.38,8.64 | v78.23,71.37 79.21,71.37 R182.2 80.81,71.12 82.42,71.12 83.48,72.18 Q165.E 83.58,72.26 84.71,72.26 85.31,71.67 R172.2 87.03,71.25 88.9,71.25 89.96,72.31 Q157.E 90.76,72.31 v91.57,71.5
  Bottom 0.203: v80.77,10.54 81.53,9.78 83.31,9.78 84.45,8.64 v87.38,8.64 90.68,8.64 91.19,9.14 92.2,9.14 92.71,8.64 95.63,8.64 | 95.63,8.64 96.01,9.02 96.01,14.73 v96.52,15.24 | v94.87,21.84 94.87,28.57 | 94.87,28.57 94.87,28.83 95.12,29.08 95.12,42.55 v96.01,43.43 | v97.79,69.72 96.77,70.74 92.33,70.74 v91.57,71.5 | v78.23,71.37 v70.87,71.37 | v95.12,28.57 94.87,28.57 | v95.76,7.11 95.76,8.51 95.63,8.64
DISCHRG_ADC3  (via drill 0.33)
  Top 0.203: v76.45,48.9 76.2,48.64 71.63,48.64 v71.37,48.39 70.36,47.37 70.36,46.86 69.22,45.72 68.37,45.72 U6.34 | v64.77,49.91 64.14,50.55 61.72,50.55 60.96,49.78 R4.1 | C5.1 J15.4
  Bottom 0.203: v76.45,48.9 76.45,51.94 75.95,52.45 75.95,61.98 76.45,62.48 77.6,62.48 78.49,63.37 79.88,63.37 J15.4 | v71.37,48.39 71.37,49.02 70.36,50.04 66.04,50.04 65.91,49.91 v64.77,49.91
ESD_NODE  (via drill 0.33)
  Top 0.203: Q110.C 39.62,6.22 42.33,6.22 Q112.C 43.18,6.99 43.94,6.22 45.89,6.22 Q114.C 46.74,6.99 47.5,6.22 49.32,6.22 Q127.C 50.33,7.07 51.05,6.35 51.94,6.35 53.09,5.21 56.13,5.21 v56.39,4.95 | v59.69,6.48 60.2,6.48 C102.1 | R116.2 C102.1 | C102.1 60.96,7.11 61.09,7.24 63.12,7.24 63.25,7.11 63.29,7.11 Q6.C 63.37,6.22 65.96,6.22 Q8.C 66.93,6.86 67.56,6.22 69.51,6.22 Q11.C
  Bottom 0.203: v56.39,4.95 57.4,5.97 59.18,5.97 v59.69,6.48
ICP1_17MA
  Top 0.203: Q140.C 89.54,4.7 90.04,4.19 J5.1
ICP1_PL  (via drill 0.33)
  Top 0.203: R144.2 82,4.15 82.3,4.45 83.69,4.45 84.2,3.94 85.78,3.94 J5.2 | v83.95,6.73 83.82,6.86 83.82,9.91 84.71,10.79 J18.2 R145.1
  Bottom 0.203: v83.95,6.73 83.95,5.77 J5.2
ICP3_17MA
  Top 0.203: J6.1 103.25,4.02 Q147.C
ICP3_PL
  Top 0.203: J19.2 99.06,11.72 R176.1 | R175.2 95.08,4.15 95.5,4.57 97.16,4.57 98.55,3.17 J6.2
  Bottom 0.203: J6.2 99.75,5.02 99.06,5.71 J19.2
IO2  (via drill 0.33)
  Top 0.203: 68.71,31.11 68.71,29.21 69.47,28.45 76.07,28.45 76.45,28.83 82.04,28.83 v82.68,29.46 | R29.2 72.99,12.91 73.91,13.84 78.61,13.84 79.38,14.61 79.38,15.37 80.01,16 80.01,16.26 80.26,16.51 J14.5
  Top 0.254: U6.11 68.2,31.62 68.71,31.11
  Bottom 0.203: v82.68,29.46 82.68,29.08 83.06,28.7 83.06,18.29
  Bottom 0.254: 83.06,18.29 J14.5
IO2_
  Top 0.203: Q12.3(D) 71.63,7.62 72.14,7.11 72.14,5.7 Q11.E 71.44,4.14 J4.3 69.54,4.11 Q11.B
IO3  (via drill 0.33)
  Top 0.203: U6.12 70.1,31.05 70.1,30.1 70.48,29.72 75.18,29.72 v75.44,29.97 | R28.2 69.05,13.42 70.1,14.48 78.23,14.48 78.74,14.99 J14.6
  Bottom 0.203: v75.44,29.97 75.06,29.97 73.91,28.83 73.91,26.04 74.3,25.65 75.31,25.65 75.82,25.15 75.82,19.43 J14.6
IO3_  (via drill 0.33)
  Top 0.203: Q10.3(D) 68.66,7.79 v69.22,7.24 | Q8.B 65.98,4.17 J4.4 67.88,4.08 Q8.E
  Bottom 0.203: v69.22,7.24 69.22,5.42 J4.4
IO4  (via drill 0.33)
  Top 0.203: U6.40 61.73,45.09 56.9,45.09 v56.64,45.34 | v55.5,24.89 56.51,23.88 72.26,23.88 72.9,24.51 74.68,24.51 v74.93,24.77 | J14.7 74.8,15.11 68.33,15.11 67.82,14.61 66.29,14.61 65.91,14.22 65.91,12.7 65.66,12.45 R16.2
  Bottom 0.203: v56.64,45.34 56.13,44.83 56.13,44.07 55.12,43.05 55.12,39.24 55.63,38.73 55.63,37.97 56.01,37.59 56.01,37.47 56.01,35.18 55.5,34.67 55.5,32.13 54.36,30.99 54.36,27.18 54.99,26.54 54.99,25.4 v55.5,24.89 | v74.93,24.77 75.18,24.51 75.18,19.18 76.2,18.16 J14.7
IO4_  (via drill 0.33)
  Top 0.203: Q7.3(D) 65.11,7.79 v65.66,7.24 | Q6.B 62.42,4.22 J4.5 64.32,4.03 Q6.E
  Bottom 0.203: v65.66,7.24 65.66,5.36 J4.5
IO5  (via drill 0.33)
  Top 0.203: v53.59,24.26 53.85,24 55.37,24 56.13,23.24 72.64,23.24 73.03,23.62 v73.41,23.62 | v36.96,38.99 37.21,38.73 42.16,38.73 44.2,40.77 51.31,40.77 53.34,38.73 53.34,37.72 v54.36,36.7 58.42,36.7 59.31,37.59 59.82,37.59 61.34,39.12 61.77,39.12 U6.44 | v9.02,40.89 R6.1
  Bottom 0.203: v54.36,36.7 54.36,35.43 54.1,35.18 54.1,32.51 53.09,31.5 53.09,24.77 v53.59,24.26 | 73.66,23.37 J14.8 | v36.96,38.99 35.81,37.85 29.08,37.85 25.78,41.15 21.84,41.15 21.21,41.78 20.45,41.78 19.18,40.51 9.4,40.51 v9.02,40.89
  Bottom 0.254: v73.41,23.62 73.66,23.37
IO6  (via drill 0.33)
  Top 0.203: U6.43 62.28,41.15 61.59,41.15 61.09,40.64 61.09,40.01 59.44,38.35 59.05,38.35 58.42,37.72 v57.02,37.72 | v57.02,39.5 56.01,39.5 55.75,39.24 53.72,39.24 51.56,41.4 43.94,41.4 41.91,39.37 38.35,39.37 v38.1,39.62 | v57.02,24.89 57.15,24.89 57.53,24.51 70.87,24.51 v71.12,24.77 | v27.94,35.31 27.9,35.31 R33.1
  Bottom 0.203: v57.02,39.5 v57.02,37.72 57.02,37.47 56.77,37.21 56.77,34.92 56.13,34.29 56.13,31.88 54.99,30.73 54.99,27.56 55.75,26.8 55.75,26.16 v57.02,24.89 | v71.12,24.77 J14.9 | v38.1,39.62 37.85,39.37 37.85,38.48 37.34,37.97 37.34,36.83 36.7,36.2 36.7,35.94 35.94,35.18 35.18,35.18 34.42,35.94 28.57,35.94 v27.94,35.31
IO7  (via drill 0.33, 0.41)
  Top 0.203: U6.26 75.66,42.55 81.41,42.55 83.19,44.32 v91.44,44.32 | v69.85,26.04 70.1,26.04 70.36,26.29 83.57,26.29 87,29.72 v91.19,29.72 | R7.1 18,3.52 v18.8,4.32 | v49.28,18.03 49.66,18.41 v55.63,18.41 | v64.9,14.22 65.91,15.24 67.31,15.24 J14.10
  Bottom 0.203: J14.10 70.48,18.41 70.48,24.13 69.85,24.77 v69.85,26.04 | v91.19,29.72 91.44,29.97 v91.44,44.32 | v18.8,4.32 19.05,4.57 23.88,4.57 24.38,5.08 24.77,5.08 25.02,5.33 28.57,5.33 28.83,5.59 29.59,5.59 30.35,4.83 33.27,4.83 34.54,3.56 35.81,3.56 36.45,4.19 36.45,4.95 36.96,5.46 37.97,5.46 39.24,6.73 39.24,6.99 43.31,11.05 43.31,13.59 44.2,14.48 45.08,14.48 45.85,15.24 47.24,15.24 48.13,16.13 48.13,17.14 48.77,17.78 49.02,17.78 v49.28,18.03 | v55.63,18.41 55.63,15.88 56.39,15.11 57.28,15.11 58.17,14.22 v64.9,14.22
IO8  (via drill 0.33)
  Top 0.203: U6.15 73.66,32.03 v73.66,30.86 | v66.93,16.13 65.79,16.13 65.41,16.51 J13.10 | v87.88,13.84 88.18,13.84 R149.2 88.81,14.69 87.63,15.88 87.63,18.58 R147.2
  Bottom 0.203: v73.66,30.86 73.66,31.37 73.28,31.75 72.26,31.75 71.76,31.24 71.76,26.8 71.5,26.54 70.61,26.54 70.23,26.92 69.47,26.92 68.96,26.42 68.96,25.53 69.22,25.27 69.22,24.38 69.85,23.75 69.85,18.67 68.96,17.78 68.07,17.78 66.93,16.64 v66.93,16.13 67.06,16.13 68.07,15.11 71.25,15.11 72.64,13.72 83.57,13.72 83.95,13.34 84.84,13.34 85.34,13.84 v87.88,13.84
IO9  (via drill 0.33)
  Top 0.203: U6.14 72.64,31.91 v72.64,30.86 | v72.39,17.53 72.14,17.78 68.07,17.78 67.31,17.02 65.79,17.02 65.02,17.78 63.88,17.78 62.61,16.51 J13.9 61.98,15.71 R187.2 | Q159.1(G) 84.27,12.26 84.58,12.57 v84.58,14.35
  Bottom 0.203: v72.64,30.86 72.39,30.73 v72.39,17.53 72.39,14.99 73.03,14.35 v84.58,14.35
IO10  (via drill 0.33)
  Top 0.203: U6.13 70.41,33.02 v70.1,33.02 | v66.93,17.91 65.91,17.91 65.41,18.41 63.63,18.41 62.99,17.78 60.71,17.78 J13.8 59.44,15.11 59.05,14.86 57.91,14.86 56.13,13.08 54.44,13.08 R133.2
  Bottom 0.203: v70.1,33.02 71.12,32 71.12,27.94 70.74,27.56 69.22,27.56 68.33,26.67 68.33,25.15 68.58,24.89 68.58,24 69.22,23.37 69.22,19.05 68.58,18.41 67.82,18.41 67.31,17.91 v66.93,17.91
IO10_  (via drill 0.33)
  Top 0.203: Q128.3(D) 52.03,7.66 v52.58,7.11 | Q127.B 49.21,4.11 J3.3 51.11,4.14 Q127.E
  Bottom 0.203: v52.58,7.11 52.58,5.98 52.58,5.97 50.15,3.54 J3.3
IO11  (via drill 0.33)
  Top 0.203: U6.16 74.68,32.14 v74.68,30.86 | v74.55,18.54 74.42,18.41 67.56,18.41 67.31,18.8 66.04,18.8 65.79,19.05 63.37,19.05 62.74,18.41 58.8,18.41 J13.7 56.9,14.86 55.75,13.72 54.1,13.72 53.59,13.21 50.76,13.21 R132.2
  Bottom 0.203: v74.68,30.86 74.68,30.61 73.15,29.08 73.15,25.27 74.55,23.88 v74.55,18.54
IO11_  (via drill 0.33)
  Top 0.203: Q126.3(D) 48.6,7.66 v49.02,7.24 | Q114.B 45.79,4.04 J3.4 47.69,4.21 Q114.E
  Bottom 0.203: v49.02,7.24 49.02,5.55 J3.4
IO12  (via drill 0.33)
  Top 0.203: U6.2 62.27,35.94 61.59,35.94 60.96,36.58 | 60.96,36.58 v60.96,37.08 | 60.96,36.58 59.31,36.58 58.8,36.07 55.12,36.07 54.86,35.81 v53.47,35.81 | J13.6 54.36,14.86 53.34,13.84 50.29,13.84 49.78,13.34 47.08,13.34 R115.2
  Bottom 0.203: v60.96,37.08 62.23,37.08 62.61,37.47 68.33,37.47 70.61,39.75 73.53,39.75 76.45,36.83 J17.1 | v53.47,35.81 53.47,32.77 52.45,31.75 52.45,21.46 54.36,19.56 J13.6
IO12_  (via drill 0.33)
  Top 0.203: Q113.3(D) 45.04,7.66 v45.47,7.24 | Q112.B 42.23,4.09 J3.5 44.13,4.16 Q112.E
  Bottom 0.203: v45.47,7.24 45.47,5.49 J3.5
IO13  (via drill 0.33)
  Top 0.203: U6.3 62.76,35.31 61.21,35.31 60.83,35.69 v60.45,35.69 59.44,35.69 59.18,35.43 55.37,35.43 55.12,35.18 54.1,35.18 53.85,34.92 53.09,34.92 52.96,35.05 v52.58,35.05 | J13.5 51.82,15.11 51.18,14.48 49.91,14.48 49.4,13.97 46.74,13.97 45.97,13.21 43.27,13.21 R114.2
  Bottom 0.203: v60.45,35.69 60.07,36.07 60.07,37.47 60.71,38.1 60.71,38.35 61.21,38.86 67.82,38.86 70.1,41.15 74.3,41.15 77.22,38.23 84.45,38.23 85.6,39.37 J17.3 | v52.58,35.05 52.83,34.8 52.83,33.02 51.82,32 J13.5
IO13_  (via drill 0.33)
  Top 0.203: Q111.3(D) 41.36,7.66 v41.91,7.11 | Q110.B 38.67,4.15 J3.6 40.57,4.1 Q110.E
  Bottom 0.203: v41.91,7.11 41.91,5.43 J3.6
IO14  (via drill 0.33)
  Top 0.203: R164.2 91.31,16.38 J14.1 91.66,16.73 R177.2
  Top 0.254: U6.1 62.42,37.28 v61.72,37.97
  Bottom 0.203: J17.4 87.76,38.1 | 87.76,38.1 85.34,38.1 84.71,37.47 76.96,37.47 74.04,40.39 70.23,40.39 68.07,38.23 61.98,38.23 v61.72,37.97 | 87.76,38.1 87.76,33.91 88.14,33.53 88.14,21.08 91.44,17.78 J14.1
IO15  (via drill 0.33, 0.41)
  Top 0.203: U6.25 76.16,41.91 81.79,41.91 83.06,43.18 v83.44,43.18 | U101.6 51.56,70.1 52.2,69.6 54.61,69.6 54.74,69.47 57.91,69.47 58.04,69.6 60.96,69.6 J9.9 63.79,69.3 R44.1 | U102.5 v41.27,57.78 41.27,58.93 42.29,59.94 46.74,59.94 48.77,61.98 51.18,61.98 52.7,63.5 53.97,63.5 54.61,64.14 54.61,65.28 55.37,66.04 57.02,66.04 58.8,67.82 63.03,67.82 R44.1 | Q146.1(G) 40.58,32.83 40.77,33.15 v41.27,33.15 | R44.1 63.79,68.41 v64.64,67.56
  Bottom 0.203: v41.27,57.78 41.27,37.21 41.02,36.96 41.02,35.69 41.27,35.43 v41.27,33.15 | v83.44,43.18 83.44,43.81 85.47,45.85 85.47,48.51 88.52,51.56 88.52,52.7 96.52,60.71 96.52,62.1 98.42,64.01 98.42,65.53 95.25,68.71 73.41,68.71 72.77,69.34 72.01,69.34 70.74,68.07 67.06,68.07 66.29,67.31 64.9,67.31 v64.64,67.56
IO16  (via drill 0.33)
  Top 0.203: U6.24 76.53,41.15 80.26,41.15 v80.65,40.77 | U101.5 52.07,71.37 52.7,70.74 58.67,70.74 58.8,70.87 J9.10 60.2,70.87 61.47,72.14 R45.1 63.92,70.83 v64.77,69.98 | U102.6 40,58.55 42.04,60.58 46.48,60.58 48.39,62.48 50.8,62.48 52.07,63.75 52.07,65.28 52.83,66.04 54.48,66.04 54.99,66.55 56.64,66.55 58.8,68.71 v62.23,68.71
  Bottom 0.203: v80.65,40.77 81.41,41.53 81.41,43.56 84.2,46.35 84.2,49.02 87.25,52.07 87.25,53.34 95.25,61.34 95.25,66.93 94.74,67.44 67.31,67.44 66.55,66.67 63.75,66.67 63.5,66.93 63.5,68.71 | v64.77,69.98 64.26,69.98 63.5,69.22 63.5,68.71 | v62.23,68.71 63.5,68.71
IO17  (via drill 0.33)
  Top 0.203: v59.18,33.15 58.67,33.15 58.55,33.02 56.77,33.02 56.51,33.27 v51.82,33.27 | 51.82,73.91 53.09,73.91 53.97,73.03 54.74,73.03 54.99,73.28 57.02,73.28 58.42,74.68 60.96,74.68 J9.5 | 51.82,73.91 U101.3 | U6.23 76.71,39.44 76.71,38.1 77.47,37.34 78.36,37.34 v79.76,35.94 | U102.3 43.81,55.37 44.32,54.86 47.12,54.86 v47.88,55.63 48.13,55.63 52.7,51.05 52.7,50.29 52.96,50.04 v52.96,49.53 | v51.82,74.3 51.82,73.91
  Bottom 0.203: v79.76,35.94 79.5,36.2 78.87,36.2 78.49,35.81 78.49,35.18 78.11,34.8 77.22,34.8 76.71,35.31 75.69,35.31 72.77,38.23 71.12,38.23 68.83,35.94 63.75,35.94 60.58,32.77 59.44,32.77 v59.18,33.15 | v47.88,55.63 45.72,57.78 45.72,65.28 49.4,68.96 49.4,73.15 50.67,74.42 51.69,74.42 v51.82,74.3 | v51.82,33.27 51.82,34.54 51.69,34.67 51.69,35.81 52.07,36.2 52.07,37.21 52.7,37.85 52.7,39.12 53.21,39.62 53.21,49.28 v52.96,49.53
IO18  (via drill 0.33)
  Top 0.203: U6.22 77.03,36.58 77.98,36.58 78.74,35.81 78.74,35.69 79.38,35.05 80.14,35.05 80.65,35.56 80.65,36.45 80.26,36.83 80.26,39.24 v82.04,41.02 | 52.7,75.18 54.36,75.18 54.99,74.55 57.02,74.55 58.17,75.69 58.17,76.71 58.67,77.22 60.45,77.22 61.09,77.85 61.59,77.85 J9.3 | 52.7,75.18 U101.2 | U102.2 45.08,57.28 45.59,57.78 v46.99,57.78 | v52.7,74.93 52.7,75.18 | v72.39,68.45 72.39,74.42 v72.26,74.55
  Bottom 0.203: v82.04,41.02 82.04,43.31 84.84,46.1 84.84,48.77 87.88,51.82 87.88,52.96 95.89,60.96 95.89,62.36 97.79,64.26 97.79,65.28 95,68.07 72.77,68.07 v72.39,68.45 | v46.99,57.78 46.35,58.42 46.35,65.02 50.04,68.71 50.04,72.9 50.55,73.41 52.07,73.41 52.7,74.04 v52.7,74.93 | v72.26,74.55 69.6,74.55 65.66,78.49 J9.3
IO19  (via drill 0.33)
  Top 0.203: U6.21 76.79,35.69 v77.6,35.69 | v60.32,33.78 60.07,33.78 59.94,33.91 58.55,33.91 58.29,33.66 57.28,33.66 56.77,34.16 52.2,34.16 51.69,34.67 51.69,35.43 52.7,36.45 52.7,36.58 v52.96,36.83 | U101.1 51.69,76.45 v52.2,75.95 54.74,75.95 54.86,75.82 57.02,75.82 57.4,76.2 57.4,77.09 58.55,78.23 58.55,79.12 59.05,79.63 60.07,79.63 61.47,81.03 J9.1 | U102.1 47.28,56.29 47.88,56.9 v47.88,57.02 48.01,57.02 48.77,56.26 48.77,55.88 53.59,51.05 v53.59,50.67
  Bottom 0.203: v77.6,35.69 77.22,36.07 76.07,36.07 73.15,38.99 70.87,38.99 68.58,36.7 62.99,36.7 61.72,35.43 61.72,35.18 v60.32,33.78 | v47.88,57.02 47.88,58.29 46.99,59.18 46.99,64.77 50.55,68.33 50.55,72.26 51.05,72.77 52.32,72.77 53.47,73.91 53.47,74.55 53.59,74.68 53.59,75.18 52.96,75.82 52.32,75.82 v52.2,75.95 | v52.96,36.83 53.34,37.21 53.34,38.73 53.85,39.24 53.85,50.42 v53.59,50.67
IO22  (via drill 0.33)
  Top 0.203: v53.97,26.04 57.15,26.04 58.04,25.15 70.23,25.15 70.74,25.65 82.55,25.65 82.93,25.27 v85.34,25.27 | v55.24,52.7 56.01,52.7 56.26,52.45 v66.42,52.45 | 73.15,59.08 73.15,58.04 72.77,57.66 v71.37,57.66 | 73.15,59.08 Q17.1(G) | 73.15,59.08 74.74,59.08 R39.1 | v54.74,38.35 56.13,38.35 56.39,38.61 58.29,38.61 60.2,40.51 60.2,40.89 61.09,41.78 62.77,41.78 U6.42
  Bottom 0.203: J14.2 87.5,17.91 85.98,17.91 85.09,18.8 85.09,24.77 85.34,25.02 v85.34,25.27 85.85,25.78 R41.1 | v55.24,52.7 54.48,52.2 54.48,38.35 | 54.48,38.35 54.48,37.97 55.24,37.21 55.24,35.43 54.86,35.05 54.86,32.38 53.72,31.24 53.72,26.29 v53.97,26.04 | v66.42,52.45 66.42,55.5 67.18,56.26 R38.1 R38.2 71.59,57.44 v71.37,57.66 | v54.74,38.35 54.48,38.35
IO23  (via drill 0.33)
  Top 0.203: U6.41 61.36,44.32 57.53,44.32 57.4,44.45 v55.24,44.45 | v48.26,71.63 49.28,72.64 U101.4 52.58,72.64 53.21,72.01 57.66,72.01 57.78,72.14 60.45,72.14 61.09,72.77 61.59,72.77 J9.7 63.5,74.68 R43.1 | U102.4 42.54,57.4 42.93,57.78 v44.45,57.78 45.08,58.42 46.35,58.42 46.61,58.67 47.75,58.67 48.77,57.66 48.77,57.28 49.4,56.64 49.4,56.13 54.61,50.93 v55.37,50.93
  Bottom 0.203: v55.37,50.93 55.24,50.8 v55.24,44.45 | v48.26,71.63 48.39,71.63 48.77,71.25 48.77,69.22 45.08,65.53 45.08,58.42 v44.45,57.78
K1
  Top 0.406: Q102.3(D) 37.3,75.14 Q103.3(D) 36.83,79.73 J11.5
K2
  Top 0.406: Q118.3(D) 33.23,75.14 Q119.3(D) 32.77,79.16 J11.4
K3
  Top 0.406: Q120.3(D) 29.42,75.14 Q133.3(D) 28.96,78.85 J11.3
K4
  Top 0.406: J11.2 25.27,78.67 Q135.3(D) 25.74,75.14 Q134.3(D)
K5
  Top 0.406: Q144.3(D) 13.55,75.39 Q145.3(D) 13.21,79.61 J12.3
K6
  Top 0.406: Q152.3(D) 9.48,75.39 Q153.3(D) 9.27,79.05 J12.2
K7
  Top 0.406: Q162.3(D) 5.42,75.39 Q163.3(D) 5.08,78.49 J12.1
N$1  (via drill 0.33)
  Top 0.203: Q136.3(D) 17.91,44.58 v18.54,45.21 | Q123.2(S) 31.54,47.58 v30.99,48.13
  Bottom 0.203: v18.54,45.21 18.67,45.34 28.32,45.34 29.21,46.23 30.35,46.23 30.73,46.61 30.73,47.88 v30.99,48.13
N$2  (via drill 0.33)
  Top 0.203: U1.7 20.55,14.76 20.83,14.48 v20.83,14.22 | 21.72,9.27 21.72,10.79 TP6.TP
  Top 0.254: R24.1 21.72,9.27
  Bottom 0.203: v20.83,14.22 22.73,14.22 22.86,14.1 22.86,11.94 TP6.TP
N$3  (via drill 0.33)
  Top 0.203: Q137.1(G) 32.06,44.01 v32.38,43.69 | v36.45,43.94 36.32,43.81 36.32,42.12 Q124.3(D) 36.79,41.91 R159.2
  Bottom 0.203: v36.45,43.94 32.64,43.94 v32.38,43.69
N$4
  Top 0.203: Q136.2(S) 15.07,43.63 D102.A
N$5
  Top 0.203: R42.1 68.33,66.8 67.31,65.79 67.31,63.54 | 67.31,63.54 R40.2 | Q16.1(G) 67.8,63.05 67.31,63.54
N$6
  Top 0.203: Q17.3(D) 70.91,60.88 71.5,61.47 71.5,63.37 69.98,64.9 69.98,66.46 R42.2
N$7  (via drill 0.33)
  Top 0.203: v11.3,46.1 11.3,46.35 10.67,46.99 10.67,48.77 9.91,49.53 U103.5 9.91,52.58 TP9.TP | Q137.3(D) 28.32,45 28.32,45.85 v27.94,46.23 27.18,45.47 R156.2
  Bottom 0.203: v11.3,46.1 11.81,45.59 17.53,45.59 18.03,46.1 27.81,46.1 v27.94,46.23
N$8  (via drill 0.33)
  Top 0.203: v50.29,43.05 50.55,43.05 57.28,49.78 R4.2 | U3.1 47.78,38.89 48.13,39.24 v50.16,39.24
  Bottom 0.203: v50.16,39.24 50.42,39.5 50.42,42.93 v50.29,43.05
N$9
  Top 0.203: R105.2 41.19,70.23 R104.1 41.09,71.22 Q104.1(G)
N$10
  Top 0.203: U1.11 20.79,17.36 21.34,17.91 22.06,17.91 | 22.16,18.01 D2.C 25.3,18.01 26.54,16.76 28.07,16.76 29.21,17.91 29.21,21.08 TP7.TP
  Top 0.254: 22.06,17.91 C1.1 22.16,18.01
N$11
  Top 0.203: Q154.E 65.72,77.03 67.63,75.12 Q155.B 67.63,71.91 R169.1
N$12
  Top 0.203: Q129.B 86.71,5.78 R134.1 87.02,5.75 Q140.E
N$13
  Top 0.203: U103.8 13.72,50.55 15.07,49.19 R140.2 15.07,49.36 16.51,50.8 TP8.TP
N$14
  Top 0.406: R141.2 16.89,48.64 15.75,47.5 14.64,47.5 R140.1 12.45,49.7 U103.7 12.45,51.56 13.34,52.45 14.64,52.45 L101.2
N$15
  Top 0.406: L101.1 23.84,53.72 D101.A | U103.1 14.35,56.01 14.86,56.52 15.37,56.52 15.62,56.77 18.29,56.77 18.54,57.02 18.92,57.02 19.81,56.13 19.81,54.61 TP10.TP 20.7,53.72 L101.1 | 21.97,53.76 L101.1
N$16
  Top 0.203: U103.3 11.18,56.77 C104.1
N$17
  Top 0.203: R146.2 92.33,5.48 Q140.B 90.48,7.17 89.54,6.22 88.9,6.22 88.52,5.84 88.52,5.33 87.76,4.57 84.45,4.57 83.19,5.84 83.19,6.14 Q129.C
N$18
  Top 0.203: Q142.E 93.16,15.54 Q130.B 94.05,20.29 R135.1
N$19  (via drill 0.33)
  Top 0.203: v93.09,22.35 Q149.C
  Bottom 0.203: J19.1 101.6,14.48 97.03,19.05 94.62,19.05 93.09,20.57 v93.09,22.35
N$20
  Top 0.203: R148.2 96.14,12.83 95.06,13.91 Q142.B 95.06,17.72 95,17.78 Q130.C
N$21  (via drill 0.33)
  Top 0.203: Q105.1(G) 41.95,77.81 42.93,76.83 v44.96,76.83 | v52.32,67.82 52.2,67.69 52.2,66.55 51.69,66.04 50.16,66.04 49.53,65.41 49.53,64.01 v50.16,63.37 | v50.93,60.33 51.18,60.33 51.56,60.71 Q106.C 56.73,60.71 R123.2
  Bottom 0.203: v44.96,76.83 45.85,76.83 46.99,75.69 50.42,75.69 51.56,76.83 52.83,76.83 55.24,74.42 55.24,73.53 54.74,73.03 54.36,73.03 52.83,71.5 52.07,71.5 51.69,71.12 51.69,68.45 v52.32,67.82 | v50.16,63.37 50.93,62.61 v50.93,60.33
N$22
  Top 0.203: Q123.3(D) 33.74,47.07 33.02,46.35 33.02,45.11 Q125.1(G) 34.12,43.77 33.65,43.31 33.65,42.73 | R131.2 32.77,42.16 33.33,42.73 33.65,42.73 | 33.65,42.73 Q124.1(G)
N$23
  Top 0.203: U1.6 14.12,14.76 13.68,14.31 C10.1 12.28,11.94 TP5.TP
N$24
  Top 0.203: R170.2 69.64,76.11 69.43,75.9 Q155.C 67.99,75.9 66.67,77.22 66.67,77.83 Q154.B
N$25
  Top 0.203: J8.2 72.35,79.76 R168.2
N$26
  Top 0.203: R155.2 24.64,45.51 R156.1 24.77,45.47 J20.2 R154.2
N$27  (via drill 0.33)
  Top 0.203: Q107.C 44.83,74.68 44.07,73.91 44.07,73.41 43.94,73.28 43.94,72.26 44.32,71.88 44.32,70.48 43.69,69.85 43.43,69.85 42.8,69.22 R105.1 42.16,69.18 42.16,67.94 42.54,67.56 Q108.C 41.7,64.69 40.39,63.37 40.39,62.48 39.5,61.59 38.73,61.59 37.59,60.45 31.5,60.45 31.24,60.71 v29.84,60.71 | Q109.C 21.46,74.42 22.1,73.79 22.1,72.26 v21.97,72.14